# Altium schematic sheet Placa_Principal_Schematic.SchDoc
size A4; SheetNumber: 1; SheetTotal: 1
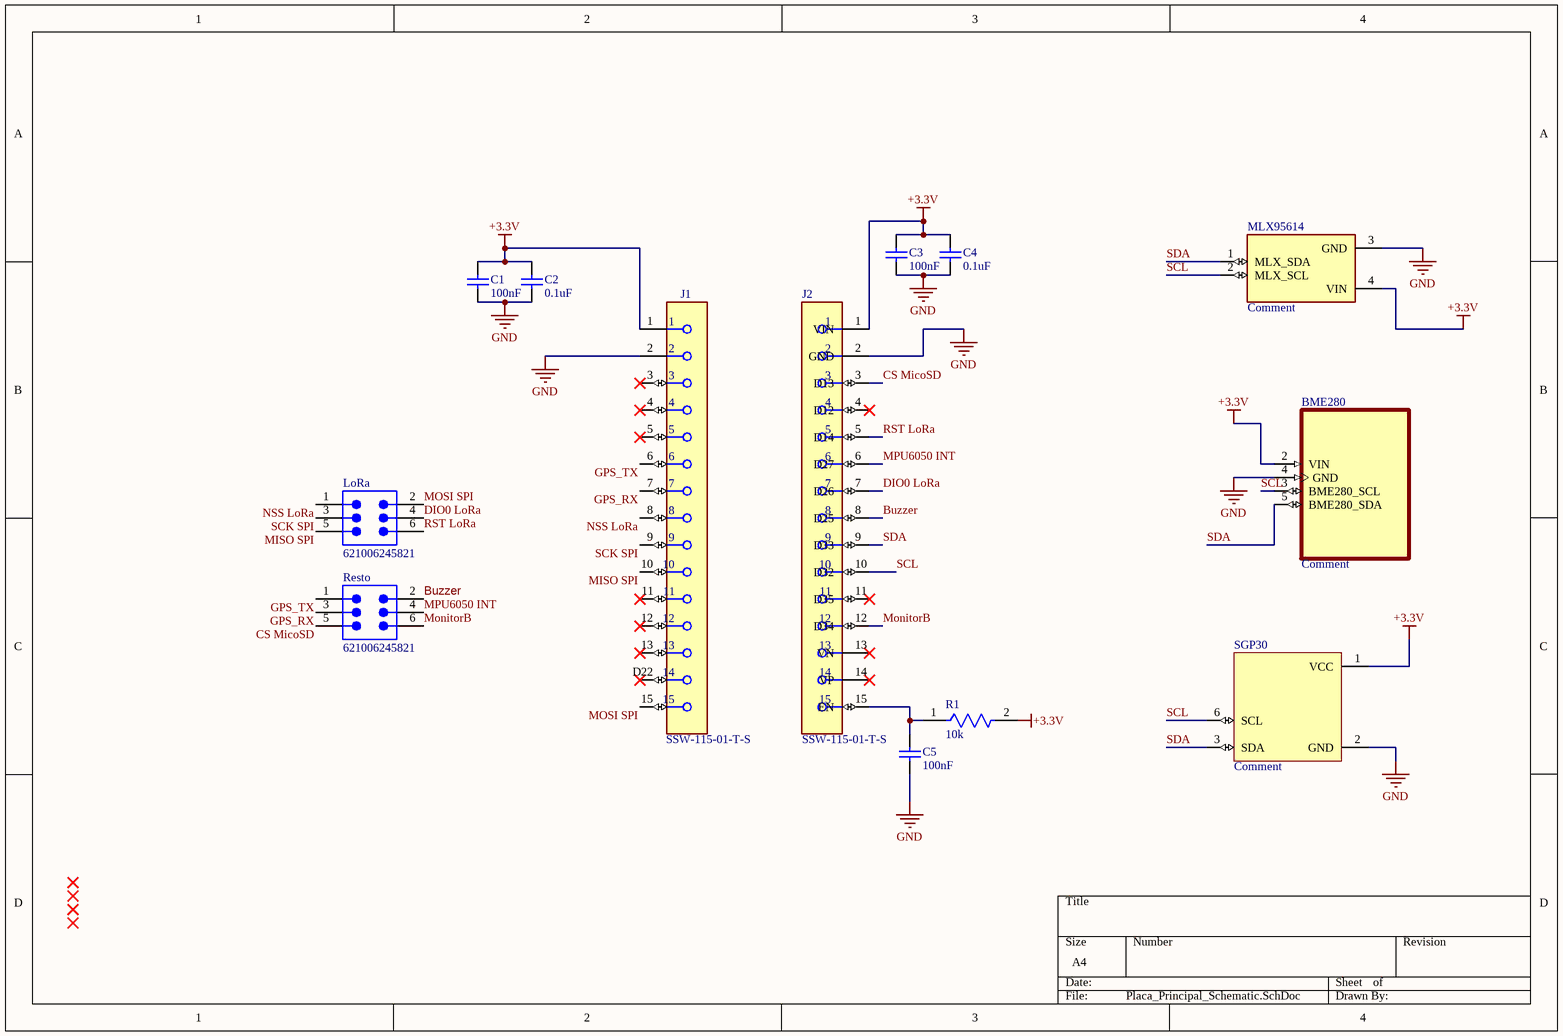
[diagram p0: Placa_Principal_Schematic.SchDoc]

## Parts
BME280  Comment  [PSON65P250X250X100-8N]
C1  100nF  [CAPC0805(2012)100_L]
C2  0.1uF  [CAPC0805(2012)100_L]
C3  100nF  [CAPC0805(2012)100_L]
C4  0.1uF  [CAPC0805(2012)100_L]
C5  100nF  [CAPC0805(2012)100_L]
J1  SSW-115-01-T-S  [FP-SSW-115-01-T-S-MFG]
J2  SSW-115-01-T-S  [FP-SSW-115-01-T-S-MFG]
LoRa  621006245821  [621006245821]
MLX95614  Comment  [TO254P942H425-4]
R1  10k  [FP-CPF0603-MFG]
Resto  621006245821  [621006245821]
SGP30  Comment  [SGP30]

## Nets
+3.3V: BME280.2(VIN) C1.2 C2.2 C3.2 C4.2 J1.1(3V3) J2.1(VIN) MLX95614.4(VIN) R1.2 SGP30.1(VCC)
GND: BME280.4(GND) C1.1 C2.1 C3.1 C4.1 C5.1 J1.2(GND) J2.2(GND) MLX95614.3(GND) SGP30.2(GND)
Buzzer: J2.8(D25) Resto.2
CS MicoSD: J2.3(D13) Resto.5
DIO0 LoRa: J2.7(D26) LoRa.4
GPS_RX: J1.7(TX2) Resto.3
GPS_TX: J1.6(RX2) Resto.1
MISO SPI: J1.10(D19) LoRa.5
MonitorB: J2.12(D34) Resto.6
MOSI SPI: J1.15(D23) LoRa.2
MPU6050 INT: J2.6(D27) Resto.4
NSS LoRa: J1.8(D5) LoRa.1
RST LoRa: J2.5(D14) LoRa.6
SCK SPI: J1.9(D18) LoRa.3
SCL: BME280.3(BME280_SCL) J2.10(D32) MLX95614.2(MLX_SCL) SGP30.6(SCL)
SDA: BME280.5(BME280_SDA) J2.9(D33) MLX95614.1(MLX_SDA) SGP30.3(SDA)
NetC5_2: C5.2 J2.15(EN) R1.1

Not connected (* = marked no-connect by the designer): BME280 1(GND) 6(VDDIO) 7(GND) 8(VDD); J1 3(D15)* 4(D2)* 5(D4)* 11(D21)* 12(RX0)* 13(TX0)* D22*; J2 4(D12)* 11(D35)* 13(VN)* 14(VP)*; SGP30 4(R) 5(VDDH) 7(EXP)

## Notes on the sheet
- (in symbol CMP-02766-001723-1) 14

## Library data of the parts
BME280 = BME280: Board Mount Humidity Sensors MEMS humidity, pressure and temperature sensor; MF: Bosch; SnapEDA_Link: https://www.snapeda.com/parts/BME280/Bosch/view-part/?ref=snap; Package: LGA-8 Bosch; Value: *; MP: BME280; Check_prices: https://www.snapeda.com/parts/BME280/Bosch/view-part/?ref=eda
C1-C5 = CMP-1036-02183-1: CAP 160pF 100V ±5% 0805 (2012 Metric) Thickness 1mm SMD; Tolerance: Â±5%; Case-Metric: 2012; Case-EIA: 0805; Technology: SMT; Rated Voltage: 100 V; Value: 160pF; Max Thickness: 1 mm
J1 J2 = CMP-02766-001723-1: CONN RCPT 15POS 0.1 TIN PCB; Connector Type: Receptacle; Max Voltage Rating (AC): 550V; Mating Cycles: 100; Number of Positions: 15; Pitch: 0.1inch; Max Current Rating: 6.9A; Contact Resistance: 10mR; Contact Type: Female Socket; Color: Black; Depth: 2.41mm; Radiation Hardening: No; Orientation: Straight; Termination: Solder; Series: SSW; Lead Free: Lead Free; Min Operating Temperature: -55°C; Contact Plating: Tin; Contact Material: Bronze; Max Operating Temperature: 105°C; Mount: Through Hole; Packaging: Bulk; Gender: Receptacle; Housing Material: Polymer; RoHS Compliant: Yes; Length: 38.61mm; Number of Rows: 1; REACH SVHC: No SVHC; Width: 2.41mm; Number of Contacts: 15; Housing Color: Black
LoRa Resto = CMP-1502-00996-4: SMT Vertical Pin Header WR-PHD, Pitch 2.00 mm, Dual Row, 6 pins; Contact Resistance: 20mΩ; Gender: Male; Current Rating: 2A; Operating Supply Voltage: 200V; RoHS: Non-Compliant; Orientation: Vertical; Lead Pitch: 2mm; Number of Pins: 6
MLX95614 = MLX90614ESF-BAA-000-TU: single pixel, 3V, standard acc., 90deg FOV; MF: Melexis; SnapEDA_Link: https://www.snapeda.com/parts/MLX90614ESF-BAA-000-TU/Melexis/view-part/?ref=snap; Package: TO-39-4 Melexis; Value: *; MP: MLX90614ESF-BAA-000-TU; Check_prices: https://www.snapeda.com/parts/MLX90614ESF-BAA-000-TU/Melexis/view-part/?ref=eda
R1 = CMP-03211-003506-1: RES SMD 10KΩ 0.5% 1/16W 0603; Manufacturer: TE Connectivity; Manufacturer Part Number: CPF0603D10KE; Power Rating: 0.063W; Temperature Coefficient: 25ppm/°C; Voltage Rating: 50V; ComponentLink2Description: Datasheet; packaging: 5k Reel; Automotive: No; Octopart: https://octopart.com/cpf0603d10ke-te+connectivity-22737789; Composition: Thin Film; Value: 10KΩ; Category: Res; RoHS: TRUE; Height: 0.55mm; Lead Free: Yes; ComponentLink2URL: https://www.te.com/commerce/DocumentDelivery/DDEController?Action=showdoc&DocId=Data+Sheet%7F1773200%7FM%7Fpdf%7FEnglish%7FENG_DS_1773200_M.pdf%7F3-1676481-2; Temperature: -55°C to +155°C; Device Class L3: Chip SMD Resistors; Device Class L1: Passive Components; octopart_url: https://octopart.com/cpf0603d10ke-te+connectivity-22737789; Tolerance: 0.5%; Resistance: 10KΩ; Package: CPF0603; Temperature Range High: +155°C; Series: CPF; Temperature Range Low: -55°C; Device Class L2: Resistors; Ipc Land Pattern Name: RESC15580X45
SGP30 = SGP